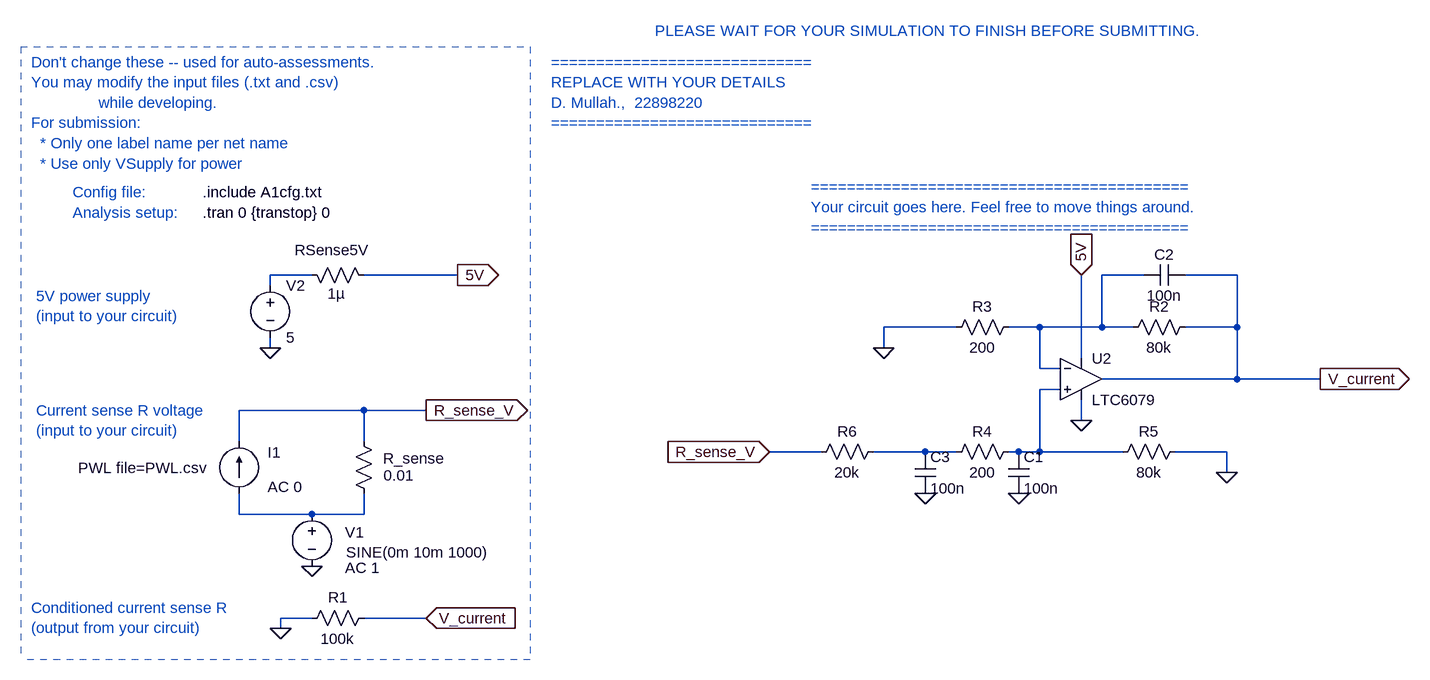
[diagram p0: schematic E344_Ass1_CurrSense.asc]
E344_Ass1_CurrSense.asc, the LTspice schematic file:
Version 4
SHEET 1 3140 2124
WIRE -1920 -1072 -1984 -1072
WIRE -1696 -1072 -1840 -1072
WIRE -640 -1072 -704 -1072
WIRE -496 -1072 -576 -1072
WIRE -1984 -1056 -1984 -1072
WIRE -928 -992 -1040 -992
WIRE -800 -992 -848 -992
WIRE -704 -992 -704 -1072
WIRE -704 -992 -800 -992
WIRE -656 -992 -704 -992
WIRE -496 -992 -496 -1072
WIRE -496 -992 -576 -992
WIRE -1984 -960 -1984 -976
WIRE -1040 -960 -1040 -992
WIRE -736 -944 -736 -1072
WIRE -800 -928 -800 -992
WIRE -768 -928 -800 -928
WIRE -496 -912 -496 -992
WIRE -496 -912 -704 -912
WIRE -368 -912 -496 -912
WIRE -768 -896 -800 -896
WIRE -1840 -864 -2032 -864
WIRE -1744 -864 -1840 -864
WIRE -736 -848 -736 -880
WIRE -2032 -816 -2032 -864
WIRE -1840 -816 -1840 -864
WIRE -1136 -800 -1216 -800
WIRE -976 -800 -1056 -800
WIRE -928 -800 -976 -800
WIRE -832 -800 -848 -800
WIRE -800 -800 -800 -896
WIRE -800 -800 -832 -800
WIRE -672 -800 -800 -800
WIRE -512 -800 -592 -800
WIRE -512 -768 -512 -800
WIRE -2032 -704 -2032 -736
WIRE -1920 -704 -2032 -704
WIRE -1840 -704 -1840 -736
WIRE -1840 -704 -1920 -704
WIRE -1920 -544 -1968 -544
WIRE -1744 -544 -1840 -544
WIRE -1968 -528 -1968 -544
FLAG -1696 -1072 5V
IOPIN -1696 -1072 Out
FLAG -1984 -960 0
FLAG -736 -1072 5V
IOPIN -736 -1072 In
FLAG -1744 -864 R_sense_V
IOPIN -1744 -864 Out
FLAG -1920 -624 0
FLAG -368 -912 V_current
IOPIN -368 -912 Out
FLAG -1216 -800 R_sense_V
IOPIN -1216 -800 In
FLAG -1744 -544 V_current
IOPIN -1744 -544 In
FLAG -1968 -528 0
FLAG -512 -768 0
FLAG -1040 -960 0
FLAG -736 -848 0
FLAG -976 -736 0
FLAG -832 -736 0
SYMBOL voltage -1984 -1072 R0
WINDOW 123 0 0 Left 0
WINDOW 39 0 0 Left 0
SYMATTR InstName V2
SYMATTR Value 5
SYMBOL res -1936 -1088 M90
WINDOW 0 -7 47 VBottom 2
WINDOW 3 29 54 VTop 2
SYMATTR InstName RSense5V
SYMATTR Value 1µ
SYMBOL res -1824 -720 R180
WINDOW 0 -109 70 Left 2
WINDOW 3 -62 44 Left 2
SYMATTR InstName R_sense
SYMATTR Value 0.01
SYMBOL current -2032 -736 R180
WINDOW 0 -64 63 Left 2
WINDOW 3 248 39 Right 2
WINDOW 123 -97 10 Left 2
WINDOW 39 0 0 Left 0
SYMATTR InstName I1
SYMATTR Value PWL file=PWL.csv
SYMATTR Value2 AC 0
SYMBOL voltage -1920 -720 R0
WINDOW 0 66 60 Bottom 2
WINDOW 3 163 59 Top 2
WINDOW 123 78 114 Bottom 2
WINDOW 39 0 0 Left 0
SYMATTR InstName V1
SYMATTR Value SINE(0m 10m 1000)
SYMATTR Value2 AC 1
SYMBOL res -1824 -560 R90
WINDOW 0 0 56 VBottom 2
WINDOW 3 32 56 VTop 2
SYMATTR InstName R1
SYMATTR Value 100k
SYMBOL OpAmps\\LTC6079 -736 -912 R0
SYMATTR InstName U2
SYMBOL res -560 -1008 R90
WINDOW 0 0 56 VBottom 2
WINDOW 3 32 56 VTop 2
SYMATTR InstName R2
SYMATTR Value 80k
SYMBOL res -832 -1008 R90
WINDOW 0 0 56 VBottom 2
WINDOW 3 32 56 VTop 2
SYMATTR InstName R3
SYMATTR Value 200
SYMBOL res -832 -816 R90
WINDOW 0 0 56 VBottom 2
WINDOW 3 32 56 VTop 2
SYMATTR InstName R4
SYMATTR Value 200
SYMBOL res -576 -816 R90
WINDOW 0 0 56 VBottom 2
WINDOW 3 32 56 VTop 2
SYMATTR InstName R5
SYMATTR Value 80k
SYMBOL cap -848 -800 R0
SYMATTR InstName C1
SYMATTR Value 100n
SYMBOL cap -576 -1088 R90
WINDOW 0 0 32 VBottom 2
WINDOW 3 32 32 VTop 2
SYMATTR InstName C2
SYMATTR Value 100n
SYMBOL cap -992 -800 R0
SYMATTR InstName C3
SYMATTR Value 100n
SYMBOL res -1040 -816 R90
WINDOW 0 0 56 VBottom 2
WINDOW 3 32 56 VTop 2
SYMATTR InstName R6
SYMATTR Value 20k
TEXT -2088 -1168 Left 2 !.tran 0 {transtop} 0
TEXT -2088 -1200 Left 2 !.include A1cfg.txt
TEXT -2352 -1400 Left 2 ;Don't change these -- used for auto-assessments.\nYou may modify the input files (.txt and .csv) \n               while developing.\nFor submission: \n  * Only one label name per net name\n  * Use only VSupply for power
TEXT -2288 -1200 Left 2 ;Config file:
TEXT -2288 -1168 Left 2 ;Analysis setup:
TEXT -1552 -1400 Left 2 ;=============================\nREPLACE WITH YOUR DETAILS\nD. Mullah.,  22898220\n=============================
TEXT -1152 -1208 Left 2 ;==========================================\nYour circuit goes here. Feel free to move things around. \n==========================================
TEXT -1392 -1448 Left 2 ;PLEASE WAIT FOR YOUR SIMULATION TO FINISH BEFORE SUBMITTING.
TEXT -2344 -1040 Left 2 ;5V power supply\n(input to your circuit)
TEXT -2344 -864 Left 2 ;Current sense R voltage\n(input to your circuit)
TEXT -2352 -560 Left 2 ;Conditioned current sense R\n(output from your circuit)
LINE Normal -1584 -1424 -1584 -480 2
LINE Normal -2368 -1424 -1584 -1424 2
LINE Normal -1584 -480 -2368 -480 2
LINE Normal -1584 -496 -1584 -496 2
LINE Normal -2368 -1424 -2368 -480 2

The netlist it stands for:
* E344_Ass1_CurrSense.asc
V2 N001 0 5
RSense5V N001 5V 1µ
R_sense N005 R_sense_V 0.01
I1 N005 R_sense_V PWL file=PWL.csv AC 0
V1 N005 0 SINE(0m 10m 1000) AC 1
R1 V_current 0 100k
XU2 N003 N002 5V 0 V_current LTC6078  ; LTC6079, pins In+ In- V+ V- OUT
R2 V_current N002 80k
R3 N002 0 200
R4 N003 N004 200
R5 0 N003 80k
C1 N003 0 100n
C2 V_current N002 100n
C3 N004 0 100n
R6 N004 R_sense_V 20k
.tran 0 {transtop} 0
.include A1cfg.txt
* Don't change these -- used for auto-assessments.
* You may modify the input files (.txt and .csv)
*                while developing.
* For submission:
*   * Only one label name per net name
*   * Use only VSupply for power
* Config file:
* Analysis setup:
* =============================
* REPLACE WITH YOUR DETAILS
* D. Mullah.,  22898220
* =============================
* ==========================================
* Your circuit goes here. Feel free to move things around.
* ==========================================
* PLEASE WAIT FOR YOUR SIMULATION TO FINISH BEFORE SUBMITTING.
* 5V power supply
* (input to your circuit)
* Current sense R voltage
* (input to your circuit)
* Conditioned current sense R
* (output from your circuit)
.lib LTC5.lib
.backanno
.end